# EAGLE design version2 (EAGLE 8.0.1)
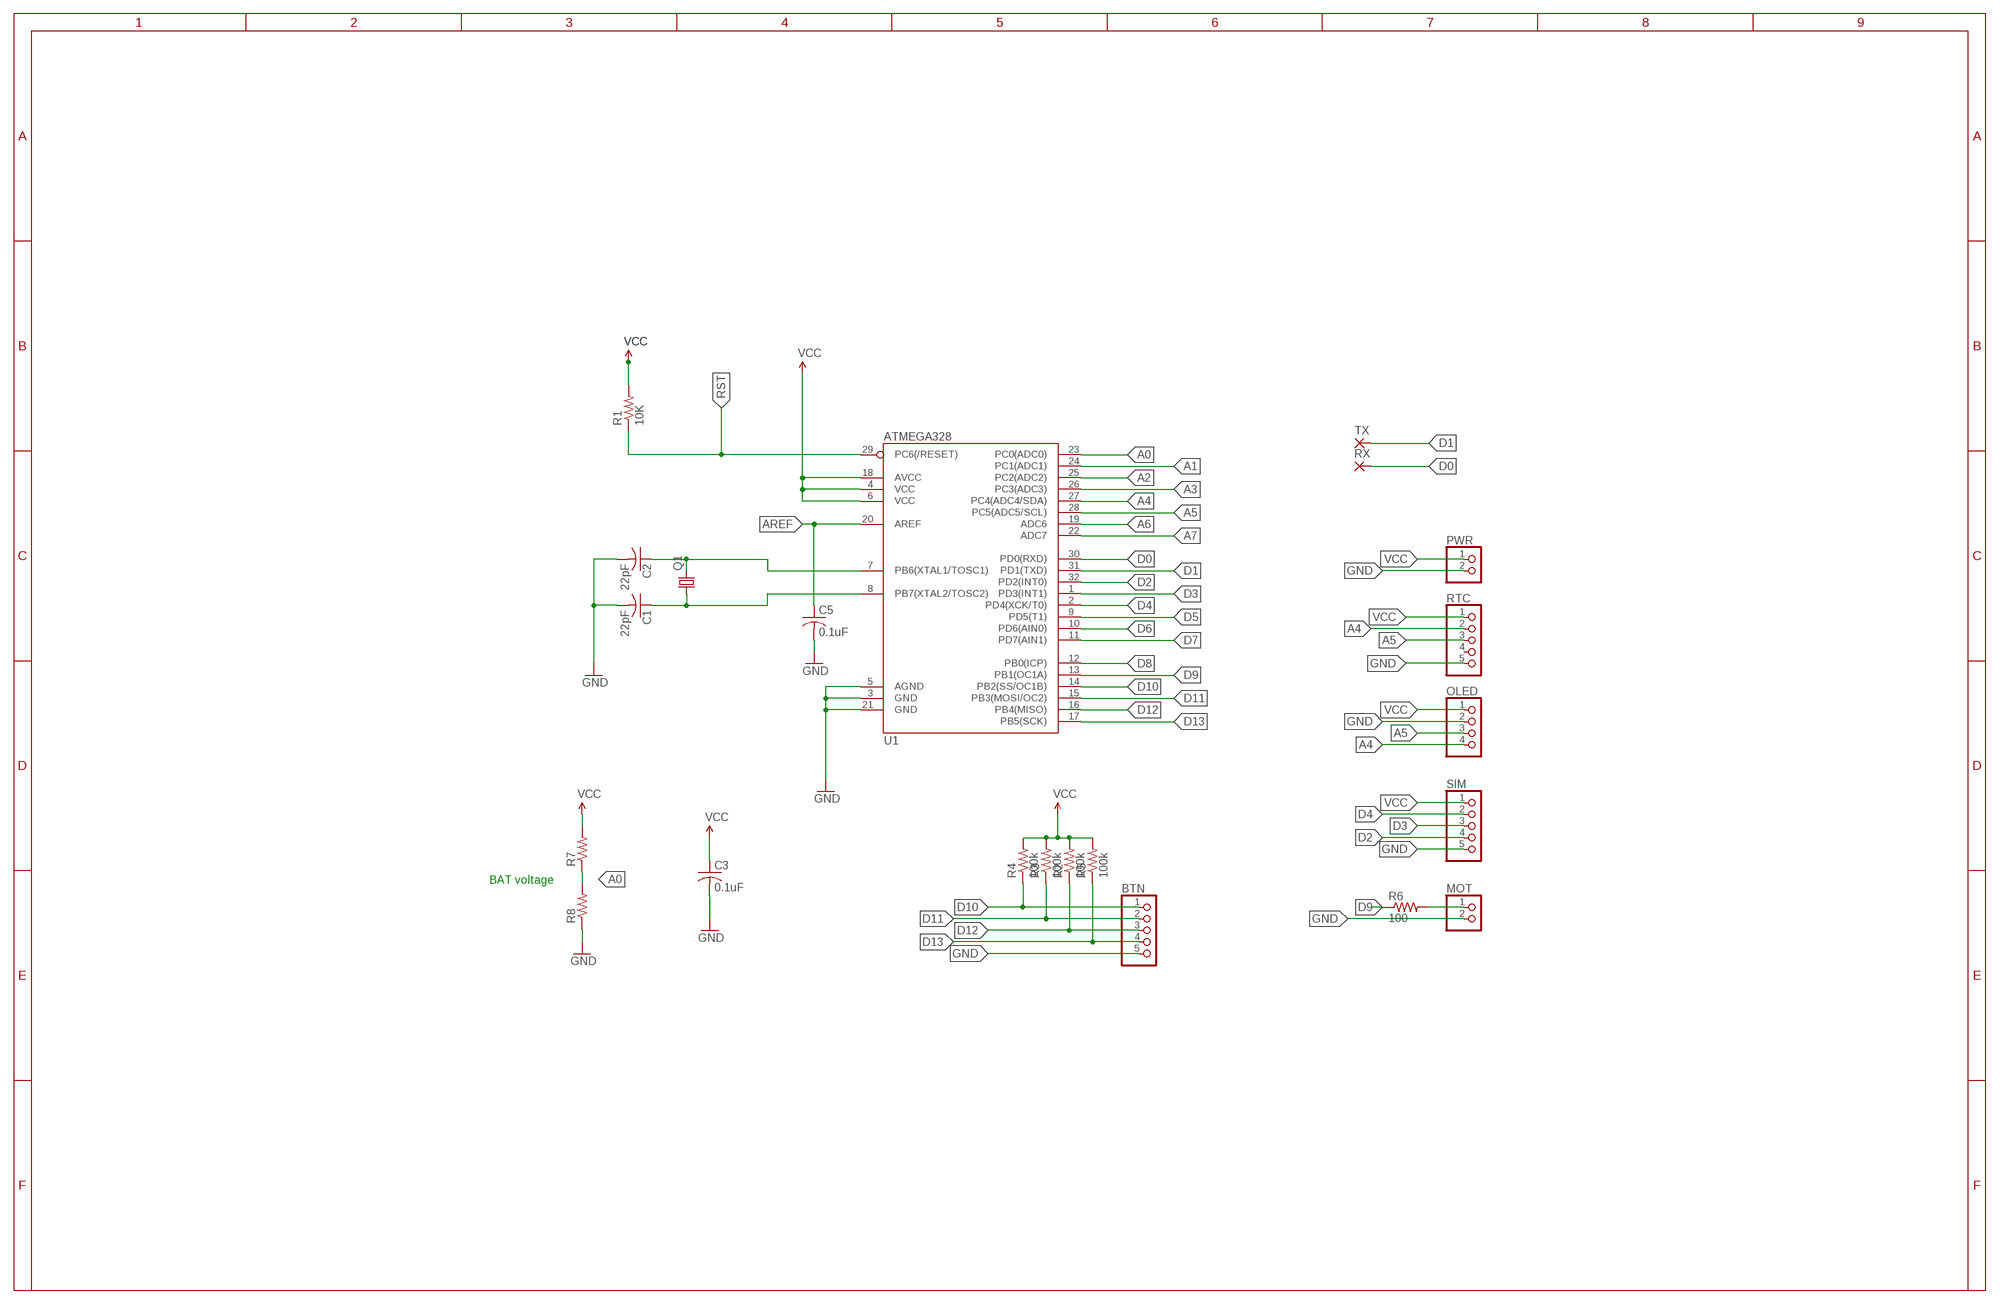
[diagram p0: schematic, sheet 1]
FRAME1 (FRAME_B_L): DESIGNER: PRATIK MAKWANA; DOC: 1; REV: 1.0.0

## Parts
BTN  PINHD-1X5  [1X05]
C1  22pF  C-USC1206  [C1206]
C2  22pF  C-USC1206  [C1206]
C3  0.1uF  C-USC0805  [C0805]
C5  0.1uF  C-USC0805  [C0805]
MOT  PINHD-1X2  [1X02]
OLED  PINHD-1X4  [1X04]
PWR  PINHD-1X2  [1X02]
Q1  CRYSTALHC18U-V  [HC18U-V]
R1  10K  R-US_R0805  [R0805]
R2  100k  R-US_R0805  [R0805]
R3  100k  R-US_R0805  [R0805]
R4  100k  R-US_R0805  [R0805]
R5  100k  R-US_R0805  [R0805]
R6  100  R-US_R0805  [R0805]
R7  R-US_R0805  [R0805]
R8  R-US_R0805  [R0805]
RTC  PINHD-1X5  [1X05]
RX  SMD2  [SMD1,27-2,54]
SIM  PINHD-1X5  [1X05]
TX  SMD2  [SMD1,27-2,54]
U1  ATMEGA328  [TQFP32-08]

## Nets
A0: R7.1 R8.2 U1.23(PC0(ADC0))
A1: U1.24(PC1(ADC1))
A2: U1.25(PC2(ADC2))
A3: U1.26(PC3(ADC3))
A4: OLED.4 RTC.2 U1.27(PC4(ADC4/SDA))
A5: OLED.3 RTC.3 U1.28(PC5(ADC5/SCL))
A6: U1.19(ADC6)
A7: U1.22(ADC7)
AREF: C5.1 U1.20(AREF)
D0: RX.1(P) U1.30(PD0(RXD))
D1: TX.1(P) U1.31(PD1(TXD))
D2: SIM.4 U1.32(PD2(INT0))
D3: SIM.3 U1.1(PD3(INT1))
D4: SIM.2 U1.2(PD4(XCK/T0))
D5: U1.9(PD5(T1))
D6: U1.10(PD6(AIN0))
D7: U1.11(PD7(AIN1))
D8: U1.12(PB0(ICP))
D9: R6.1 U1.13(PB1(OC1A))
D10: BTN.1 R4.1 U1.14(PB2(SS/OC1B))
D11: BTN.2 R3.1 U1.15(PB3(MOSI/OC2))
D12: BTN.3 R2.1 U1.16(PB4(MISO))
D13: BTN.4 R5.1 U1.17(PB5(SCK))
GND: BTN.5 C1.2 C2.2 C3.2 C5.2 MOT.2 OLED.2 PWR.2 R8.1 RTC.5 SIM.5 U1.3(GND) U1.5(AGND) U1.21(GND)
N$1: MOT.1 R6.2
N$43: C2.1 Q1.2 U1.7(PB6(XTAL1/TOSC1))
N$44: C1.1 Q1.1 U1.8(PB7(XTAL2/TOSC2))
RST: R1.1 U1.29(PC6(/RESET))
VCC: C3.1 OLED.1 PWR.1 R1.2 R2.2 R3.2 R4.2 R5.2 R7.2 RTC.1 SIM.1 U1.4(VCC) U1.6(VCC) U1.18(AVCC)
Unconnected: RTC.4

## Notes on the sheet
- BAT voltage

## Library data of the parts
BTN RTC SIM = pinhead:PINHD-1X5: PIN HEADER
C1-C3 C5 = adafruit:C-US: CAPACITOR, American symbol
MOT PWR = pinhead:PINHD-1X2: PIN HEADER
OLED = pinhead:PINHD-1X4: PIN HEADER
Q1 = adafruit:CRYSTAL: CRYSTAL; OC_FARNELL: unknown; OC_NEWARK: unknown
R1-R8 = adafruit:R-US_: RESISTOR, American symbol
RX TX = wirepad:SMD2: SMD PAD
U1 = thecustomgeek:ATMEGA328: ATmega328P-AU TQFP 32 pin

## Board
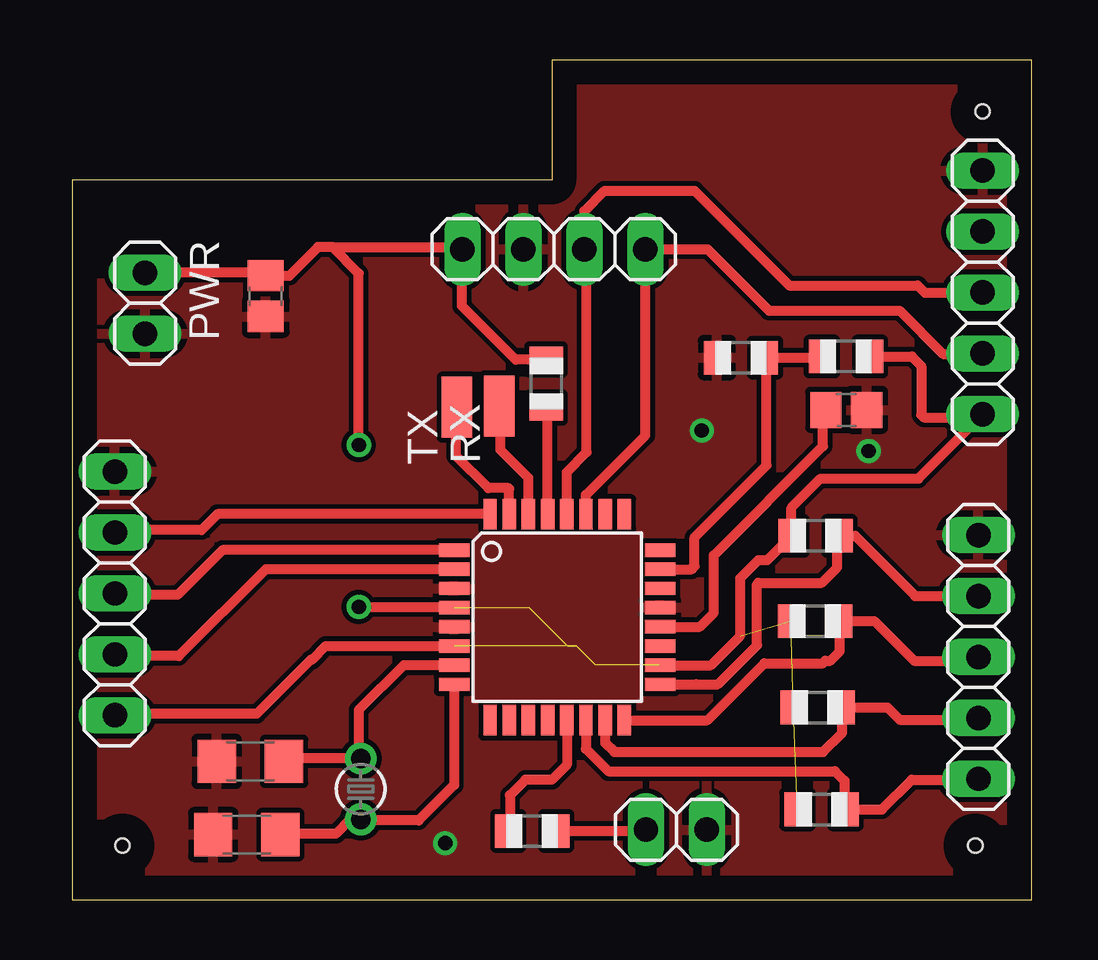
[diagram p1: board, top side]
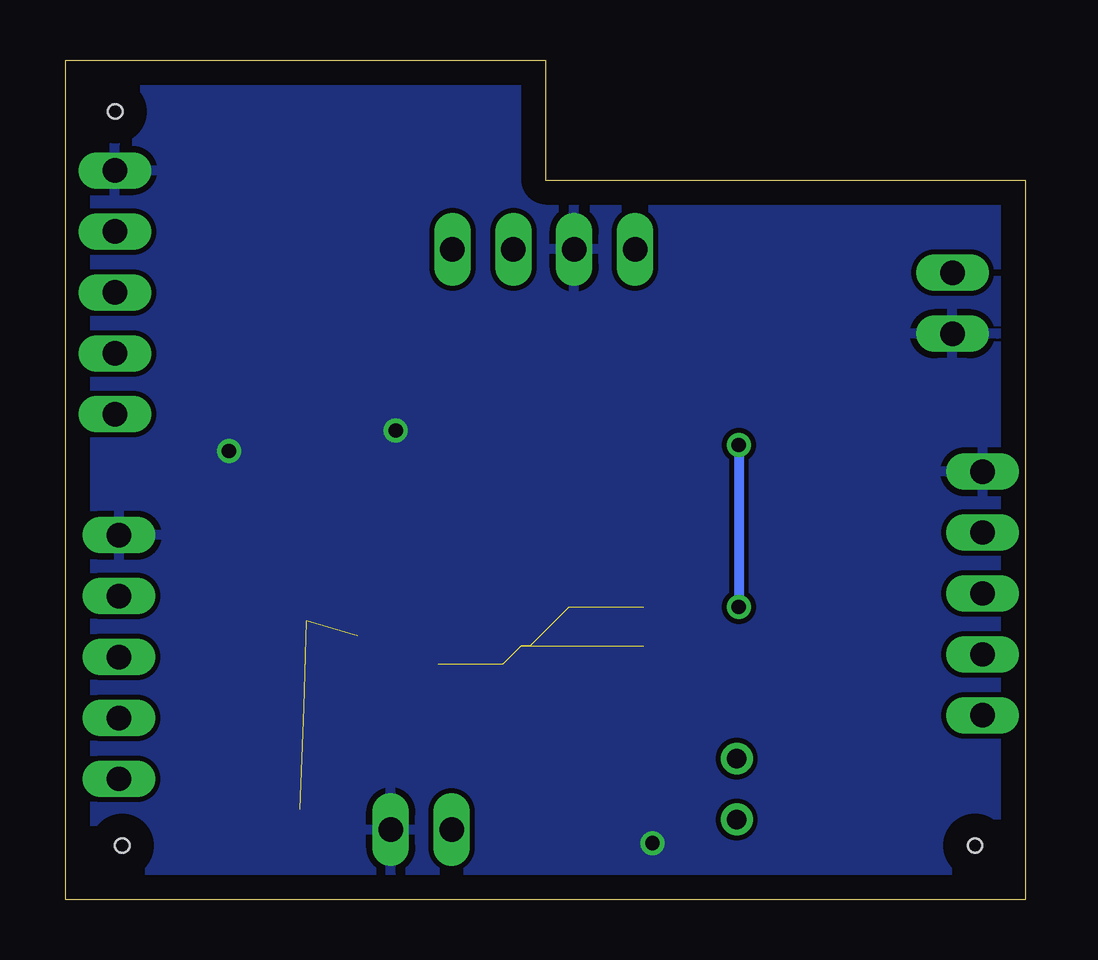
[diagram p2: board, bottom side, seen from below]

Size 40 x 35 mm. Coordinates in mm from the lower left corner, seen from the top.
Outline: 0,0 40,0 40,35 20,35 20,30 0,30 0,0
Copper layers (1*16): Top 0.035mm / dielectric 1.5mm / Bottom 0.035mm
Design rules "default": minimum track width 10mil, minimum drill 24mil, track to track 8mil, track to pad 8mil, pad to pad 8mil, via to via 8mil, smd to smd 8mil, copper to edge 40mil, drill to drill 8mil, minimum pad ring 10mil, minimum via ring 8mil, stop-mask expansion 4mil, vias tented up to drill 0mil, thermal gap 10mil
Holes 0.6 mm at 2.1,2.25 37.65,2.25 37.95,32.85

### Footprints (pad centres in the part's own frame; a part is rotated, then mirrored left to right if it is on the bottom)
1X05 = drill 1.016 long: 1 -5.08,0; 2 -2.54,0; 3 0,0; 4 2.54,0; 5 5.08,0
C1206 = smd 1.6 x 1.8: 1 -1.4,0; 2 1.4,0
C0805 = smd 1.3 x 1.5: 1 -0.85,0; 2 0.85,0
1X02 = drill 1.016 long: 1 -1.27,0; 2 1.27,0
1X04 = drill 1.016 long: 1 -3.81,0; 2 -1.27,0; 3 1.27,0; 4 3.81,0
TC26V = drill 0.813: 1 -1.27,0; 2 1.27,0
R0805 = smd 1.1 x 1.4: 1 -1,0; 2 1,0
SMD1,27-2,54 = smd 1.27 x 2.54: 1 0,0
TQFP32-08 = smd 1.27 x 0.559: 1 -4.293,2.8; 2 -4.293,2; 3 -4.293,1.2; 4 -4.293,0.4; 5 -4.293,-0.4; 6 -4.293,-1.2; 7 -4.293,-2; 8 -4.293,-2.8; 17 4.293,-2.8; 18 4.293,-2; 19 4.293,-1.2; 20 4.293,-0.4; 21 4.293,0.4; 22 4.293,1.2; 23 4.293,2; 24 4.293,2.8 | smd 0.559 x 1.27: 9 -2.8,-4.293; 10 -2,-4.293; 11 -1.2,-4.293; 12 -0.4,-4.293; 13 0.4,-4.293; 14 1.2,-4.293; 15 2,-4.293; 16 2.8,-4.293; 25 2.8,4.293; 26 2,4.293; 27 1.2,4.293; 28 0.4,4.293; 29 -0.4,4.293; 30 -1.2,4.293; 31 -2,4.293; 32 -2.8,4.293

### Placement (x,y rotation side)
BTN  37.78,10.11 90 top
C1  7.28,2.71 180 top
C2  7.43,5.76 180 top
C3  8.07,25.16 270 top
C5  32.27,20.41 0 top
MOT  25.19,2.91 0 top
OLED  20.08,27.11 0 top
PWR  3.04,24.86 270 top
Q1  16MHz  [TC26V]  12.03,4.61 90 top
R1  19.76,21.51 90 top
R2  30.97,11.61 180 top
R3  31.07,8.01 180 top
R4  31.24,3.76 180 top
R5  30.99,15.16 180 top
R6  19.18,2.86 0 top
R7  32.26,22.64 0 top
R8  27.88,22.59 0 top
RTC  37.96,25.31 90 top
RX  17.81,20.58 0 top
SIM  1.78,12.76 90 top
TX  16.04,20.53 0 top
U1  20.22,11.77 0 top

### Tracks (layer width: path | path; a pad name or v marks a point on that pad's centre or on a via)
A0
  Top 0.406: U1.23 25.82,13.77 25.95,13.9 25.95,15.1 28.95,18.1 28.95,22.52 R8.2 31.21,22.59 R7.1
A4
  Top 0.406: U1.27 21.42,16.87 23.9,19.35 OLED.4 26.49,27.11 29.05,24.55 34.5,24.55 36.3,22.75 37.94,22.75 RTC.2
A5
  Top 0.406: U1.28 20.62,17.82 21.45,18.65 21.45,27.01 OLED.3 21.35,28.7 22.2,29.55 25.95,29.55 29.9,25.6 35.25,25.6 35.55,25.3 RTC.3
AREF
  Top 0.406: U1.20 26.17,11.37 26.75,11.95 26.75,14.35 31.3,18.9 31.3,20.29 C5.1
D0
  Top 0.406: U1.30 19.02,17.58 17.85,18.75 17.85,20.54 RX.1
D1
  Top 0.406: U1.31 18.22,17.13 18.2,17.15 17.35,17.15 16,18.5 16,20.49 TX.1
D2
  Top 0.406: U1.32 6.06,16.06 5.4,15.4 1.88,15.4 SIM.4
D3
  Top 0.406: U1.1 6.27,14.57 4.4,12.7 1.84,12.7 SIM.3
D4
  Top 0.406: U1.2 8.07,13.77 4.45,10.15 1.85,10.15 SIM.2
D9
  Top 0.406: U1.13 20.62,5.62 20,5 18.9,5 18.25,4.35 18.25,2.93 R6.1
D10
  Top 0.406: U1.14 21.42,6.28 22.35,5.35 31.8,5.35 32.2,4.95 32.2,3.8 R4.1 33.76,3.76 35,5 37.75,5 BTN.1
D11
  Top 0.406: U1.15 22.22,6.53 22.6,6.15 31.3,6.15 32.1,6.95 32.1,7.98 R3.1 33.99,8.01 34.5,7.5 37.71,7.5 BTN.2
D12
  Top 0.406: U1.16 26.48,7.48 28.85,9.85 31.3,9.85 31.4,9.95 31.6,9.95 32,10.35 32,11.58 R2.1 33.44,11.61 35.1,9.95 37.62,9.95 BTN.3
D13
  Top 0.406: U1.17 25,8.97 | 25,8.97 26.02,8.97 | BTN.4 35.15,12.65 32.64,15.16 R5.1 31.9,15.07 31.9,13.85 31.25,13.2 28.6,13.2 28.55,13.15 28.55,10.6 26.92,8.97 25,8.97
GND  (via drill 0.6)
  other vias: 33.2,18.7 15.55,2.35 26.25,19.55
  pour Top: 20,35 20,30 0,30 0,0 40,0 40,35
  pour Bottom: 0,30 0,0 40,0 40,35 20,35 20,30
N$1
  Top 0.406: R6.2 23.87,2.86 MOT.1
N$43
  Top 0.406: U1.7 13.82,9.77 11.95,7.9 11.95,5.96 Q1.2 8.95,5.88 C2.1
N$44
  Top 0.406: U1.8 15.93,4.78 14.45,3.3 12.07,3.3 Q1.1 11.59,3.34 11,2.75 8.72,2.75 C1.1
RST
  Top 0.406: U1.29 19.82,20.45 R1.1
VCC  (via drill 0.6)  (9 unrouted)
  Top 0.406: PWR.1 7.95,26.13 C3.1 9.06,26.01 10.25,27.2 10.85,27.2 | 10.85,27.2 16.18,27.2 OLED.1 16.25,27.09 16.25,24.75 18.49,22.51 R1.2 | U1.6 10.57,10.57 10,10 9.95,10 7.7,7.75 1.85,7.75 SIM.1 | R7.2 35.01,22.64 35.4,22.25 35.4,20.2 35.5,20.1 37.83,20.1 RTC.1 35.28,17.55 31.2,17.55 29.99,16.34 R5.2 28.98,14.15 28.6,14.15 27.85,13.4 27.85,11 26.62,9.77 U1.18 24.48,9.8 | v11.95,12.2 15.9,12.2 U1.4 | v11.95,18.95 11.95,26.1 10.85,27.2
  Bottom 0.406: v11.95,18.95 v11.95,12.2